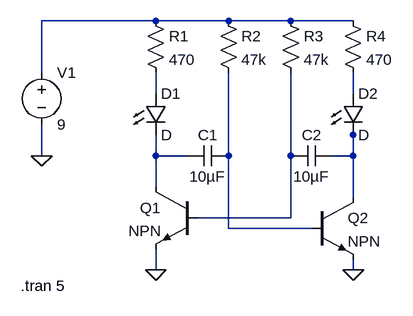
[diagram p0: schematic astablemultivibrator.asc]
astablemultivibrator.asc, the LTspice schematic file:
Version 4
SHEET 1 880 680
WIRE -256 176 -432 176
WIRE -144 176 -256 176
WIRE -48 176 -144 176
WIRE 48 176 -48 176
WIRE -432 256 -432 176
WIRE -256 288 -256 256
WIRE 48 288 48 256
WIRE 48 352 48 336
WIRE -432 384 -432 336
WIRE -256 384 -256 352
WIRE -208 384 -256 384
WIRE -144 384 -144 256
WIRE -48 384 -48 256
WIRE 48 384 48 352
WIRE 48 384 16 384
WIRE -256 432 -256 384
WIRE 48 448 48 384
WIRE -48 480 -48 384
WIRE -48 480 -192 480
WIRE -144 496 -144 384
WIRE -16 496 -144 496
WIRE -256 560 -256 528
WIRE 48 560 48 544
FLAG -432 384 0
FLAG -256 560 0
FLAG 48 560 0
SYMBOL voltage -432 240 R0
WINDOW 123 0 0 Left 0
WINDOW 39 0 0 Left 0
SYMATTR InstName V1
SYMATTR Value 9
SYMBOL res -272 160 R0
SYMATTR InstName R1
SYMATTR Value 470
SYMBOL res -160 160 R0
SYMATTR InstName R2
SYMATTR Value 47k
SYMBOL res -64 160 R0
SYMATTR InstName R3
SYMATTR Value 47k
SYMBOL res 32 160 R0
SYMATTR InstName R4
SYMATTR Value 470
SYMBOL LED -272 288 R0
SYMATTR InstName D1
SYMBOL LED 32 288 R0
SYMATTR InstName D2
SYMBOL cap -144 368 R90
WINDOW 0 0 32 VBottom 2
WINDOW 3 32 32 VTop 2
SYMATTR InstName C1
SYMATTR Value 10µF
SYMBOL cap 16 368 R90
WINDOW 0 0 32 VBottom 2
WINDOW 3 32 32 VTop 2
SYMATTR InstName C2
SYMATTR Value 10µF
SYMBOL npn -16 448 R0
SYMATTR InstName Q2
SYMBOL npn -192 432 M0
SYMATTR InstName Q1
TEXT -464 584 Left 2 !.tran 5

The netlist it stands for:
* astablemultivibrator.asc
V1 N001 0 9
R1 N001 N002 470
R2 N001 N006 47k
R3 N001 N007 47k
R4 N001 N003 470
D1 N002 N005 D
D2 N003 N004 D
C1 N006 N005 10µF
C2 N004 N007 10µF
Q2 N004 N006 0 0 NPN
Q1 N005 N007 0 0 NPN
.model D D
.lib standard.dio
.model NPN NPN
.model PNP PNP
.lib standard.bjt
.tran 5
.backanno
.end